# Altium schematic sheet Connectors.SchDoc
size A4
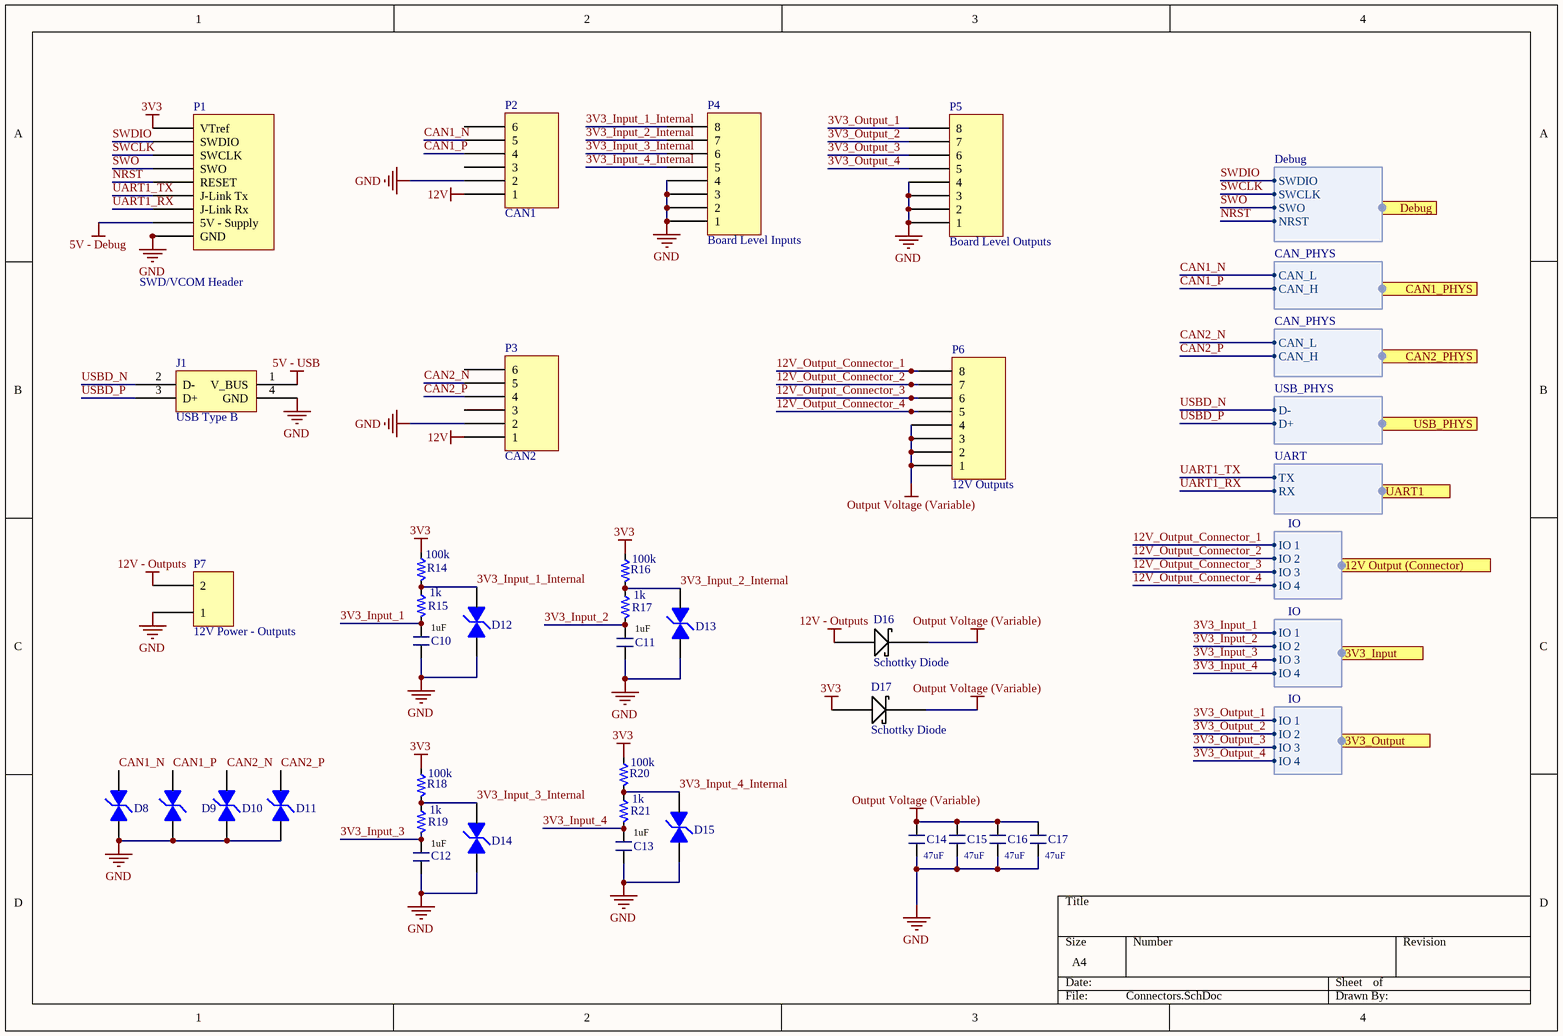
[diagram p0: Connectors.SchDoc]

## Parts
C10  Capacitance: 1uF  [PCB_GENERIC_SMD_0603]  (hidden comment: SCH_GENERIC_CAPACITOR_0603)
C11  Capacitance: 1uF  [PCB_GENERIC_SMD_0603]  (hidden comment: SCH_GENERIC_CAPACITOR_0603)
C12  Capacitance: 1uF  [PCB_GENERIC_SMD_0603]  (hidden comment: SCH_GENERIC_CAPACITOR_0603)
C13  Capacitance: 1uF  [PCB_GENERIC_SMD_0603]  (hidden comment: SCH_GENERIC_CAPACITOR_0603)
C14  Capacitance: 47uF  [PCB_GENERIC_CAPACITOR_1210]  (hidden comment: SCH_GENERIC_CAPACITOR_1210)
C15  Capacitance: 47uF  [PCB_GENERIC_CAPACITOR_1210]  (hidden comment: SCH_GENERIC_CAPACITOR_1210)
C16  Capacitance: 47uF  [PCB_GENERIC_CAPACITOR_1210]  (hidden comment: SCH_GENERIC_CAPACITOR_1210)
C17  Capacitance: 47uF  [PCB_GENERIC_CAPACITOR_1210]  (hidden comment: SCH_GENERIC_CAPACITOR_1210)
D8  TVS Diode  [TVS Diode]  (value not drawn)
D9  TVS Diode  [TVS Diode]  (value not drawn)
D10  TVS Diode  [TVS Diode]  (value not drawn)
D11  TVS Diode  [TVS Diode]  (value not drawn)
D12  TVS Diode  [TVS Diode]  (value not drawn)
D13  TVS Diode  [TVS Diode]  (value not drawn)
D14  TVS Diode  [TVS Diode]  (value not drawn)
D15  TVS Diode  [TVS Diode]  (value not drawn)
D16  Schottky Diode  [ON Semi Schottky Diode - MBRM110LT1G]
D17  Schottky Diode  [ON Semi Schottky Diode - MBRM110LT1G]
J1  USB Type B  [0670688000]
P1  SWD/VCOM Header  [Samtec TST-110-01-G-D]
P2  CAN1  [PCB_MLX_MICROFIT_3X2]
P3  CAN2  [PCB_MLX_MICROFIT_3X2]
P4  Board Level Inputs  [PCB_MLX_MICROFIT_4X2]
P5  Board Level Outputs  [PCB_MLX_MICROFIT_4X2]
P6  12V Outputs  [PCB_MLX_MICROFIT_4X2]
P7  12V Power - Outputs  [Molex Mini-Fit Jr 2x1]
R14  Resistance: 100k  [PCB_GENERIC_SMD_0603]  (hidden comment: SCH_GENERIC_RESISTOR_0603)
R15  Resistance: 1k  [PCB_GENERIC_SMD_0603]  (hidden comment: SCH_GENERIC_RESISTOR_0603)
R16  Resistance: 100k  [PCB_GENERIC_SMD_0603]  (hidden comment: SCH_GENERIC_RESISTOR_0603)
R17  Resistance: 1k  [PCB_GENERIC_SMD_0603]  (hidden comment: SCH_GENERIC_RESISTOR_0603)
R18  Resistance: 100k  [PCB_GENERIC_SMD_0603]  (hidden comment: SCH_GENERIC_RESISTOR_0603)
R19  Resistance: 1k  [PCB_GENERIC_SMD_0603]  (hidden comment: SCH_GENERIC_RESISTOR_0603)
R20  Resistance: 100k  [PCB_GENERIC_SMD_0603]  (hidden comment: SCH_GENERIC_RESISTOR_0603)
R21  Resistance: 1k  [PCB_GENERIC_SMD_0603]  (hidden comment: SCH_GENERIC_RESISTOR_0603)

## Ports
3V3_Input (harness IO), 3V3_Output (harness IO), 12V Output (Connector) (harness IO), CAN1_PHYS (harness CAN_PHYS), CAN2_PHYS (harness CAN_PHYS), Debug (harness Debug), UART1 (harness UART), USB_PHYS (harness USB_PHYS)

## Harnesses
Debug: SWDIO, SWCLK, SWO, NRST
CAN_PHYS: CAN_L, CAN_H
USB_PHYS: D-, D+
UART: TX, RX
IO: IO 1, IO 2, IO 3, IO 4

## Nets
3V3: D17.2 P1.1(VTref) R14.1 R16.1 R18.1 R20.1
5V - Debug: P1.19(5V_-_Supply)
5V - USB: J1.1(V_BUS)
12V: P2.1 P3.1
12V - Outputs: D16.2 P7.2
GND: C10.1 C11.1 C12.1 C13.1 C14.1 C15.1 C16.1 C17.1 D8.2 D9.2 D10.2 D11.2 D12.2 D13.2 D14.2 D15.2 J1.4(GND) P1.4(GND) P1.6(GND) P1.8(GND) P1.10(GND) P1.12(GND) P2.2 P3.2 P4.1 P4.2 P4.3 P4.4 P5.1 P5.2 P5.3 P5.4 P7.1
Output Voltage (Variable): C14.2 C15.2 C16.2 C17.2 D16.1 D17.1 P6.1 P6.2 P6.3 P6.4
3V3_Input_1: C10.2 R15.2 ; port 3V3_Input.IO 1
3V3_Input_1_Internal: D12.1 P4.8 R14.2 R15.1
3V3_Input_2: C11.2 R17.2 ; port 3V3_Input.IO 2
3V3_Input_2_Internal: D13.1 P4.7 R16.2 R17.1
3V3_Input_3: C12.2 R19.2 ; port 3V3_Input.IO 3
3V3_Input_3_Internal: D14.1 P4.6 R18.2 R19.1
3V3_Input_4: C13.2 R21.2 ; port 3V3_Input.IO 4
3V3_Input_4_Internal: D15.1 P4.5 R20.2 R21.1
3V3_Output_1: P5.8 ; port 3V3_Output.IO 1
3V3_Output_2: P5.7 ; port 3V3_Output.IO 2
3V3_Output_3: P5.6 ; port 3V3_Output.IO 3
3V3_Output_4: P5.5 ; port 3V3_Output.IO 4
12V_Output_Connector_1: P6.8 ; port 12V Output (Connector).IO 1
12V_Output_Connector_2: P6.7 ; port 12V Output (Connector).IO 2
12V_Output_Connector_3: P6.6 ; port 12V Output (Connector).IO 3
12V_Output_Connector_4: P6.5 ; port 12V Output (Connector).IO 4
CAN1_N: D8.1 P2.5 ; port CAN1_PHYS.CAN_L
CAN1_P: D9.1 P2.4 ; port CAN1_PHYS.CAN_H
CAN2_N: D10.1 P3.5 ; port CAN2_PHYS.CAN_L
CAN2_P: D11.1 P3.4 ; port CAN2_PHYS.CAN_H
NRST: P1.15(RESET) ; port Debug.NRST
SWCLK: P1.9(SWCLK) ; port Debug.SWCLK
SWDIO: P1.7(SWDIO) ; port Debug.SWDIO
SWO: P1.13(SWO) ; port Debug.SWO
UART1_RX: P1.17(J-Link_Rx) ; port UART1.RX
UART1_TX: P1.5(J-Link_Tx) ; port UART1.TX
USBD_N: J1.2(D-) ; port USB_PHYS.D-
USBD_P: J1.3(D+) ; port USB_PHYS.D+

Not connected (* = marked no-connect by the designer): P2 3 6; P3 3 6

## Library data of the parts
C10-C13 = SCH_GENERIC_CAPACITOR_0603: Generic SMD capacitor 0603; Tolerance: *%
C14-C17 = SCH_GENERIC_CAPACITOR_1210: Generic SMD capacitor 1210
D8-D15 = TVS Diode: Manufacturer: Bourns; Manufacturer ID: CDSOD323-T03SC
D16 D17 = ON Semi Schottky Diode - MBRM110LT1G
J1 = 0670688000
P2 P3 = SCH_MLX_MICROFIT_3X2
P4-P6 = SCH_MLX_MICROFIT_4X2: Molex Microfit Connector 4x2
P7 = Molex Mini-Fit 1x2
R14-R21 = SCH_GENERIC_RESISTOR_0603: Generic SMD resistor 0603